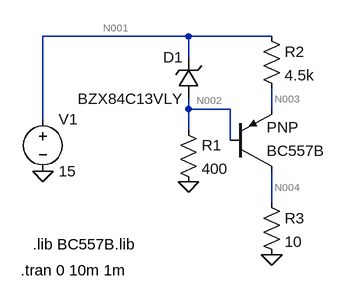
[diagram p0: schematic Zener.asc]
Zener.asc, the LTspice schematic file:
Version 4
SHEET 1 880 680
WIRE 112 0 -112 0
WIRE 240 0 112 0
WIRE 112 32 112 0
WIRE 112 112 112 96
WIRE 176 112 112 112
WIRE 240 112 240 80
WIRE -112 128 -112 0
WIRE 112 144 112 112
WIRE 176 160 176 112
WIRE 240 256 240 208
FLAG 112 224 0
FLAG -112 208 0
FLAG 240 336 0
SYMBOL pnp 176 208 M180
SYMATTR InstName BC557B
SYMBOL voltage -112 112 R0
WINDOW 123 0 0 Left 0
WINDOW 39 0 0 Left 0
SYMATTR InstName V1
SYMATTR Value 15
SYMBOL zener 128 96 R180
WINDOW 0 24 64 Left 2
WINDOW 3 24 0 Left 2
SYMATTR InstName D1
SYMATTR Value BZX84C13VLY
SYMBOL res 96 128 R0
SYMATTR InstName R1
SYMATTR Value 400
SYMBOL res 224 -16 R0
SYMATTR InstName R2
SYMATTR Value 4.5k
SYMBOL res 224 240 R0
SYMATTR InstName R3
SYMATTR Value 10
TEXT -128 320 Left 2 !.lib BC557B.lib
TEXT -146 360 Left 2 !.tran 0 10m 1m

The netlist it stands for:
* Zener.asc
Q§BC557B N004 N002 N003 0 PNP
V1 N001 0 15
D1 N002 N001 BZX84C13VLY
R1 N002 0 400
R2 N001 N003 4.5k
R3 N004 0 10
.model D D
.lib standard.dio
.model NPN NPN
.model PNP PNP
.lib standard.bjt
.lib BC557B.lib
.tran 0 10m 1m
.backanno
.end

* Results of the author's LTspice run, read from the files saved beside the schematic
* Operating Point, zero values left out:
*   V(n004) = 26.89 mV
*   V(n002) = 1.979 V
*   V(n003) = 2.779 V
*   V(n001) = 15 V
*   Ic(Bc557b) = -2.689 mA
*   Ib(Bc557b) = -26.89 µA
*   Ie(Bc557b) = 2.716 mA
*   I(D1) = -4.921 mA
*   I(R1) = 4.948 mA
*   I(R2) = 2.716 mA
*   I(R3) = 2.689 mA
*   I(V1) = -7.637 mA